# EAGLE design firstProject_1.1 (EAGLE 6.6.0)
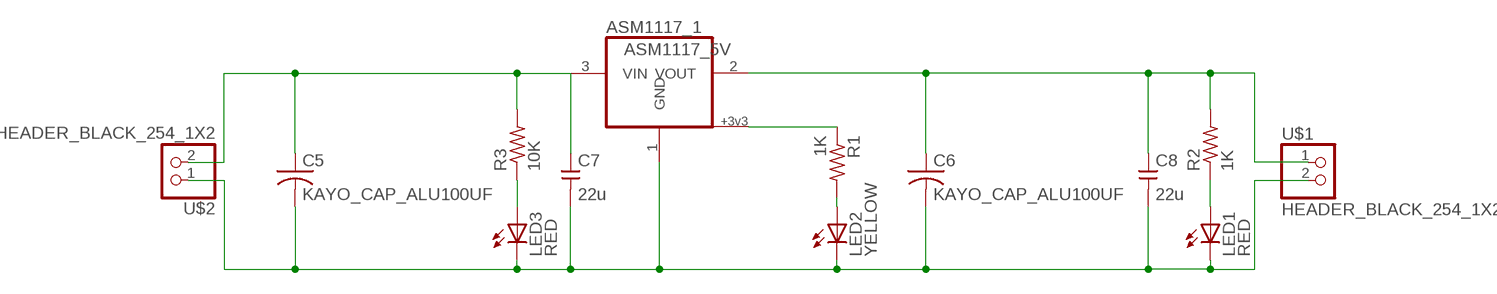
[diagram p0: schematic, sheet 1]

## Parts
ASM1117_1  ASM1117_5V  KAYO_REG1117_SOT223_ASM1117_5V  [SOT223]
C5  KAYO_CAP_ALU100UF  [RCL_PANASONIC_D]
C6  KAYO_CAP_ALU100UF  [RCL_PANASONIC_D]
C7  22u  KAYO_CAP_CERAMIC22UF_KXN_0603  [KXN_C0603]
C8  22u  KAYO_CAP_CERAMIC22UF_KXN_0603  [KXN_C0603]
LED1  RED  KAYO_LED_RED_KXN_LED_0603  [KXN_LED_0603]
LED2  YELLOW  KAYO_LED_YELLOW_KXN_LED_0603  [KXN_LED_0603]
LED3  RED  KAYO_LED_RED_KXN_LED_0603  [KXN_LED_0603]
R1  1K  R-US_1K_R0603_KXN  [R0603_KXN]
R2  1K  R-US_1K_R0603_KXN  [R0603_KXN]
R3  10K  R-US_10K_R0603_KXN  [R0603_KXN]
U$1  HEADER_BLACK_254_1X2  KXN_HEADER_1X2  [HEADER_1X2_254]
U$2  HEADER_BLACK_254_1X2  KXN_HEADER_1X2  [HEADER_1X2_254]

## Nets
GND: ASM1117_1.1(GND) C5.- C6.- C7.2(-) C8.2(-) LED1.C LED2.C LED3.C U$1.2 U$2.1
N$2: LED3.A R3.1
N$3: ASM1117_1.3(VIN) C5.+ C7.1(+) R3.2 U$2.2
N$4: ASM1117_1.2(VOUT) C6.+ C8.1(+) R2.2 U$1.1
N$5: LED2.A R1.2
N$6: LED1.A R2.1
N$7: ASM1117_1.4 R1.1

## Library data of the parts
ASM1117_1 = kxnStandard_IC_Power:KAYO_REG1117: 800mA and 1A Low Dropout (LDO) Positive Regulator 1.8V, 2.5V, 2.85V, 3.3V, 5V, and Adj; CC_COST: 1.78; CC_ID: 552788893163; CC_SHOP: CongCo; INFO: SOT223 ASM1117 5V 800mA; KXN_ID: SAreg20585; LINK_MH: https://banlinhkien.com/lm1117mpx5.0v-sot223-800ma-5v-n06a-p12912495.html; MPN: REG1117; OC_FARNELL: 1097566; OC_NEWARK: 14P6981
C5 C6 = kxnStandard_capacitor:KAYO_CAP_ALU; CC_SHOP: CongCo; INFO: 100uF 16V size 6.3*5.4mm; LINK_MH: testlink-100uF16V
C7 C8 = kxnStandard_capacitor:KAYO_CAP_CERAMIC; CC_SHOP: CongCo; INFO: C0603 22uF 10V
LED1 LED3 = kxnStandard_led:KAYO_LED: LED OSRAM: - CHIPLED LG R971, LG N971, LY N971, LG Q971, LY Q971, LO R971, LY R971 LH N974, LH R974 LS Q976, LO Q976, LY Q976 LO Q996 - Hyper CHIPLED LW Q18S LB Q993, LB Q99A, LB R99A - SideLED LS A670, LO A670, LY A670, LG A670, LP A670 LB A673, LV A673, LT A673, LW A673 LH A674 LY A675 LS A676, LA A676, LO A676, LY A676, LW A676 LS A679, LY A679, LG A679 - Hyper Micro SIDELED® LS Y876, LA Y876, LO Y876, LY Y876 LT Y87S - SmartLED LW L88C, LW L88S LB L89C, LB L89S, LG L890 LS L89K, LO L89K, LY L89K LS L896, LA L896, LO L896, LY L896 - TOPLED LS T670, LO T670, LY T670, LG T670, LP T670 LSG T670, LSP T670, LSY T670, LOP T670, LYG T670 LG T671, LOG T671, LSG T671 LB T673, LV T673, LT T673, LW T673 LH T674 LS T676, LA T676, LO T676, LY T676, LB T676, LH T676, LSB T676, LW T676 LB T67C, LV T67C, LT T67C, LS T67K, LO T67K, LY T67K, LW E67C LS E67B, LA E67B, LO E67B, LY E67B, LB E67C, LV E67C, LT E67C LW T67C LS T679, LY T679, LG T679 LS T770, LO T770, LY T770, LG T770, LP T770 LB T773, LV T773, LT T773, LW T773 LH T774 LS E675, LA E675, LY E675, LS T675 LS T776, LA T776, LO T776, LY T776, LB T776 LHGB T686 LT T68C, LB T68C - Hyper Mini TOPLED® LB M676 - Mini TOPLED Santana® LG M470 LS M47K, LO M47K, LY M47K Source: http://www.osram.convergy.de/; CC_COST: 0.025; CC_ID: 522554271548; CC_LINK: https://item.taobao.com/item.htm?id=522554271548&skuId=5766142345185; CC_OPTION: 0603_红色(20只); CC_SHOP: CongCo; INFO: Led 0603 RED; JLC_PART_COST: 0.0056; JLC_PART_ID: C2286; JLC_PART_LINK: https://jlcpcb.com/partdetail/Hubei_KentoElec-KT0603R/C2286; KXN_ID: SA12131249
LED2 = kxnStandard_led:KAYO_LED: LED OSRAM: - CHIPLED LG R971, LG N971, LY N971, LG Q971, LY Q971, LO R971, LY R971 LH N974, LH R974 LS Q976, LO Q976, LY Q976 LO Q996 - Hyper CHIPLED LW Q18S LB Q993, LB Q99A, LB R99A - SideLED LS A670, LO A670, LY A670, LG A670, LP A670 LB A673, LV A673, LT A673, LW A673 LH A674 LY A675 LS A676, LA A676, LO A676, LY A676, LW A676 LS A679, LY A679, LG A679 - Hyper Micro SIDELED® LS Y876, LA Y876, LO Y876, LY Y876 LT Y87S - SmartLED LW L88C, LW L88S LB L89C, LB L89S, LG L890 LS L89K, LO L89K, LY L89K LS L896, LA L896, LO L896, LY L896 - TOPLED LS T670, LO T670, LY T670, LG T670, LP T670 LSG T670, LSP T670, LSY T670, LOP T670, LYG T670 LG T671, LOG T671, LSG T671 LB T673, LV T673, LT T673, LW T673 LH T674 LS T676, LA T676, LO T676, LY T676, LB T676, LH T676, LSB T676, LW T676 LB T67C, LV T67C, LT T67C, LS T67K, LO T67K, LY T67K, LW E67C LS E67B, LA E67B, LO E67B, LY E67B, LB E67C, LV E67C, LT E67C LW T67C LS T679, LY T679, LG T679 LS T770, LO T770, LY T770, LG T770, LP T770 LB T773, LV T773, LT T773, LW T773 LH T774 LS E675, LA E675, LY E675, LS T675 LS T776, LA T776, LO T776, LY T776, LB T776 LHGB T686 LT T68C, LB T68C - Hyper Mini TOPLED® LB M676 - Mini TOPLED Santana® LG M470 LS M47K, LO M47K, LY M47K Source: http://www.osram.convergy.de/; CC_COST: 0.045; CC_ID: 522554271548; CC_LINK: https://item.taobao.com/item.htm?id=522554271548&skuId=5766142345187; CC_OPTION: 0603_黄色(20只); CC_SHOP: CongCo; INFO: Led 0603 YELLOW; JLC_PART_COST: 0.0099; JLC_PART_ID: C2287; JLC_PART_LINK: https://jlcpcb.com/partdetail/Hubei_KentoElec-KT0603Y/C2287; KXN_ID: SA73414714
R1 R2 = kxnStandard_resistor:R-US_: RESISTOR, American symbol; CC_COST: 0.016; CC_ID: 525795113143; CC_LINK: https://item.taobao.com/item.htm?id=525795113143; CC_SHOP: CongCo; INFO: R0603 1K 1%; JLC_PART_COST: 0.0010; JLC_PART_ID: C21190; JLC_PART_LINK: https://jlcpcb.com/partdetail/21904-0603WAF1001T5E/C21190; KXN_ID: SA35169456
R3 = kxnStandard_resistor:R-US_: RESISTOR, American symbol; CC_SHOP: CongCo; INFO: R0603 10K 1%
U$1 U$2 = kxnStandard_connector:KXN_HEADER_1X2; CC_SHOP: CongCo

## Board
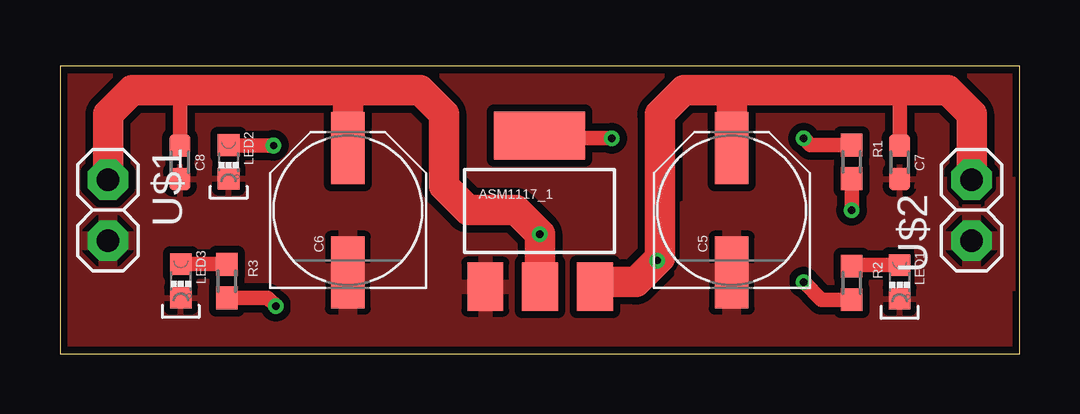
[diagram p1: board, top side]
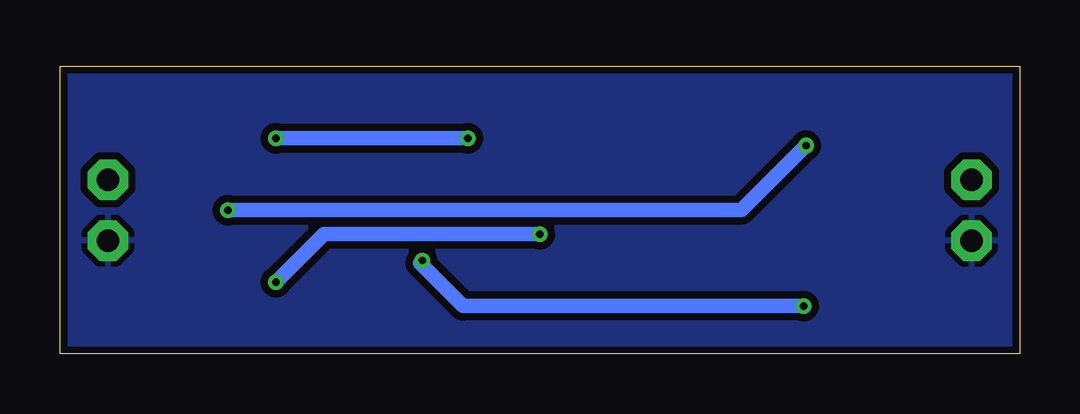
[diagram p2: board, bottom side, seen from below]

Size 40 x 12 mm. Coordinates in mm from the lower left corner, seen from the top.
Outline: 0,0 40,0 40,12 0,12 0,0
Copper layers (1*16): Top 0.035mm / dielectric 1.5mm / Bottom 0.035mm
Design rules "SparkFun-2-Layer-General-JLCPCB_kxnUsing": minimum track width 7mil, minimum drill 0.3mm, track to track 7mil, track to pad 7mil, pad to pad 7mil, via to via 7mil, smd to smd 7mil, copper to edge 7mil, drill to drill 7mil, minimum pad ring 7mil, minimum via ring 7mil, stop-mask expansion 0mil, vias tented up to drill 0.3mm, thermal gap 10mil

### Footprints (pad centres in the part's own frame; a part is rotated, then mirrored left to right if it is on the bottom)
SOT223 = smd 2.007 x 1.499: 1 3.15,-2.261; 2 3.15,0.025; 3 3.15,2.311 | smd 2.007 x 3.81: 4 -3.15,0
RCL_PANASONIC_D = smd 3 x 1.4: + 2.6,0; - -2.6,0
KXN_C0603 = smd 0.95 x 0.9: 1 -0.7,0; 2 0.7,0
KXN_LED_0603 = smd 0.9 x 0.9: A 0.7,0; C -0.7,0
R0603_KXN = smd 0.95 x 0.9: 1 -0.7,0; 2 0.7,0
HEADER_1X2_254 = drill 0.95 pad 1.676 octagon: 1 -1.27,0; 2 1.27,0

### Placement (x,y rotation side)
ASM1117_1  19.99,5.96 270 top
C5  28,6 90 top
C6  12,6 90 top
C7  35,8 270 top
C8  5,8 270 top
LED1  35,3.01 90 top
LED2  7.03,8.02 90 top
LED3  5.04,3.05 90 top
R1  33,8.02 270 top
R2  33,2.97 270 top
R3  6.96,3.04 270 top
U$1  2,6 270 top
U$2  38,6 90 top

### Tracks (layer width: path | path; a pad name or v marks a point on that pad's centre or on a via)
GND
  pour Top (isolate 0.305, rank 6): 0,12 40,12 40,0 0,0
  pour Top (isolate 0.3, rank 6): 4,3 0,3 0,7 4,7
  pour Top (rank 6): 10,6 14,6 14,1 10,1
  pour Top (rank 6): 26,6 30,6 30,1 26,1
  pour Top (rank 5): 40,3 36,3 36,7 40,7
  pour Bottom (isolate 0.3, rank 6): 0,0 0,12 40,12 40,0
  pour Top (isolate 0.3, rank 6): 15,12 25,12 25,0 15,0
N$2
  Top 0.61: LED3.A R3.1
N$3  (via drill 0.3 pad 0.61)
  Top 0.61: C7.1 35,11 | R3.2 8.66,2.34 v9,2
  Top 1.27: ASM1117_1.3 22.49,3 24,3 v24.9,3.9 25,4 25,10 26,11 28,11 | 28,11 35,11 37,11 38,10 U$2.2 | C5.+ 28,11
  Bottom 0.61: v9,2 23.2,2 25,3.8 v24.9,3.9
N$4  (via drill 0.3 pad 0.61)
  Top 0.61: C8.1 5,11 | R2.2 31.73,2.27 v31,3
  Top 1.27: U$1.1 2,10 3,11 5,11 12,11 | C6.+ 12,11 | 12,11 15,11 16,10 16,7 17,6 19,6 v20,5 20,2.83 ASM1117_1.2
  Bottom 0.61: v31,3 29,5 v20,5
N$5  (via drill 0.3 pad 0.61)
  Top 0.61: R1.2 v33,6 | v8.9,8.7 7.05,8.7 LED2.A
  Bottom 0.61: v33,6 11.6,6 v8.9,8.7
N$6
  Top 0.61: LED1.A 33.04,3.71 R2.1
N$7  (via drill 0.3 pad 0.61)
  Top 0.61: R1.1 31.28,8.72 v31,9 | v23,9 20.1,9 ASM1117_1.4
  Bottom 0.61: v31,9 v23,9